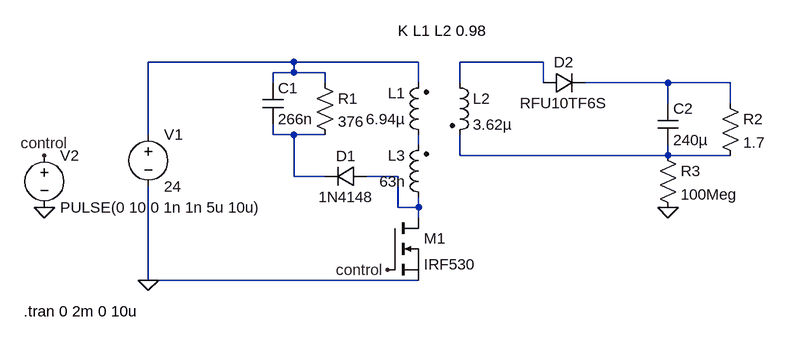
[diagram p0: schematic Banco de prueba Fuente PARASITA.asc]
Banco de prueba Fuente PARASITA.asc, the LTspice schematic file:
Version 4
SHEET 1 908 680
WIRE 176 48 -48 48
WIRE 368 48 176 48
WIRE 560 48 432 48
WIRE 176 64 176 48
WIRE 176 64 144 64
WIRE 224 64 176 64
WIRE 144 80 144 64
WIRE 224 80 224 64
WIRE 368 80 368 48
WIRE 432 80 432 48
WIRE 560 80 560 48
WIRE 752 80 624 80
WIRE 848 80 752 80
WIRE 752 112 752 80
WIRE 848 112 848 80
WIRE -48 160 -48 48
WIRE 144 160 144 144
WIRE 176 160 144 160
WIRE 224 160 176 160
WIRE 368 176 368 160
WIRE 432 192 432 160
WIRE 752 192 752 176
WIRE 752 192 432 192
WIRE 848 192 752 192
WIRE 176 224 176 160
WIRE 224 224 176 224
WIRE 336 224 288 224
WIRE 336 272 336 224
WIRE 368 272 368 256
WIRE 368 272 336 272
WIRE 368 288 368 272
WIRE -48 384 -48 240
WIRE 368 384 -48 384
FLAG 752 272 0
FLAG -48 384 0
FLAG -208 272 0
FLAG -208 192 control
FLAG 320 368 control
SYMBOL cap 128 80 R0
SYMATTR InstName C1
SYMATTR Value 266n
SYMBOL res 208 64 R0
SYMATTR InstName R1
SYMATTR Value 376
SYMBOL diode 288 208 R90
WINDOW 0 0 32 VBottom 2
WINDOW 3 32 32 VTop 2
SYMATTR InstName D1
SYMATTR Value 1N4148
SYMBOL diode 560 96 R270
WINDOW 0 32 32 VTop 2
WINDOW 3 0 32 VBottom 2
SYMATTR InstName D2
SYMATTR Value RFU10TF6S
SYMBOL ind2 384 176 R180
WINDOW 0 36 80 Left 2
WINDOW 3 36 40 Left 2
SYMATTR InstName L1
SYMATTR Value 6.94µ
SYMATTR Type ind
SYMBOL ind2 416 64 R0
SYMATTR InstName L2
SYMATTR Value 3.62µ
SYMATTR Type ind
SYMBOL nmos 320 288 R0
SYMATTR InstName M1
SYMATTR Value IRF530
SYMBOL cap 736 112 R0
SYMATTR InstName C2
SYMATTR Value 240µ
SYMBOL res 832 96 R0
SYMATTR InstName R2
SYMATTR Value 1.7
SYMBOL voltage -48 144 R0
WINDOW 123 0 0 Left 0
WINDOW 39 0 0 Left 0
SYMATTR InstName V1
SYMATTR Value 24
SYMBOL voltage -208 176 R0
WINDOW 123 0 0 Left 0
WINDOW 39 0 0 Left 0
SYMATTR InstName V2
SYMATTR Value PULSE(0 10 0 1n 1n 5u 10u)
SYMBOL res 736 176 R0
SYMATTR InstName R3
SYMATTR Value 100Meg
SYMBOL ind2 384 272 R180
WINDOW 0 36 80 Left 2
WINDOW 3 36 40 Left 2
SYMATTR InstName L3
SYMATTR Value 63n
SYMATTR Type ind
TEXT -240 432 Left 2 !.tran 0 2m 0 10u
TEXT 336 0 Left 2 !K L1 L2 0.98

The netlist it stands for:
* Banco de prueba Fuente PARASITA.asc
C1 N001 N004 266n
R1 N001 N004 376
D1 N007 N004 1N4148
D2 N002 N003 RFU10TF6S
L1 N005 N001 6.94µ
L2 N002 N006 3.62µ
M1 N007 control 0 0 IRF530
C2 N003 N006 240µ
R2 N003 N006 1.7
V1 N001 0 24
V2 control 0 PULSE(0 10 0 1n 1n 5u 10u)
R3 N006 0 100Meg
L3 N007 N005 63n
.model D D
.lib standard.dio
.model NMOS NMOS
.model PMOS PMOS
.lib standard.mos
.tran 0 2m 0 10u
K L1 L2 0.98
.backanno
.end